# Altium project adapter.PrjPcb
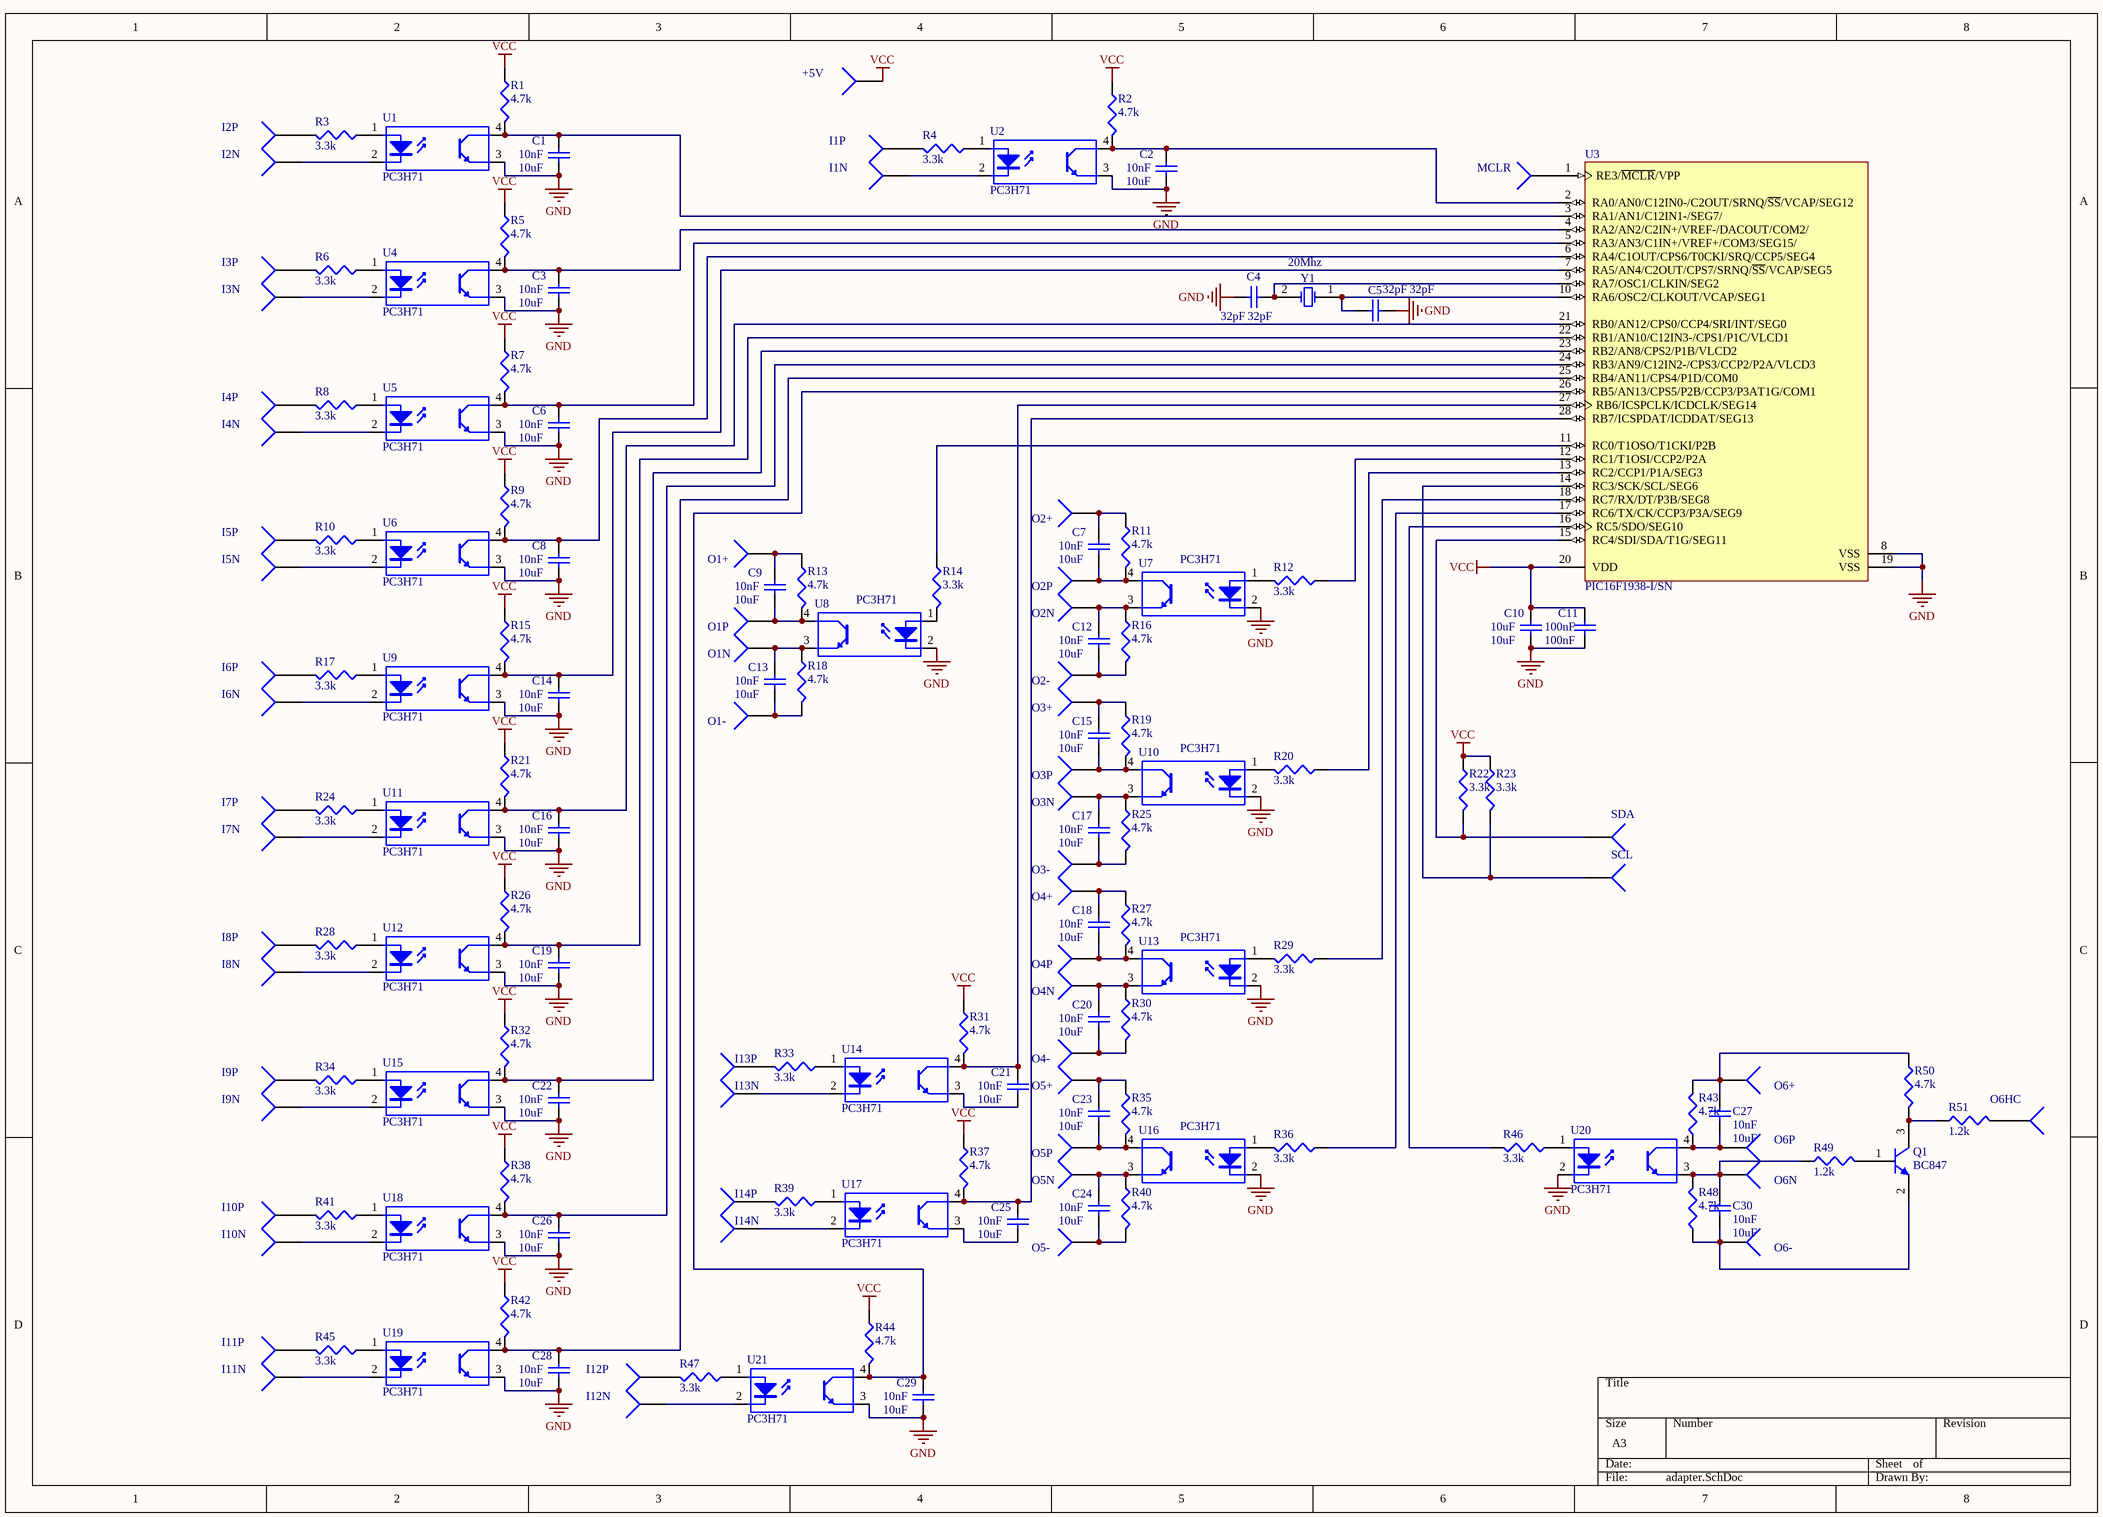
[diagram p0: adapter.SchDoc]
1 sheet, 161 parts. Net scope: global (net labels, ports and power ports of the same name join across sheets).
Board file: adapter.PcbDoc

## Sheet adapter.SchDoc
size A3

### Parts
+5V  IN  [PIN1L]  (value not drawn)
C1  10nF  value 10uF  [1608[0603]]
C2  10nF  value 10uF  [1608[0603]]
C3  10nF  value 10uF  [1608[0603]]
C4  32pF  [1608[0603]]
C5  32pF  [1608[0603]]
C6  10nF  value 10uF  [1608[0603]]
C7  10nF  value 10uF  [1608[0603]]
C8  10nF  value 10uF  [1608[0603]]
C9  10nF  value 10uF  [1608[0603]]
C10  10uF  [1608[0603]]
C11  100nF  [1608[0603]]
C12  10nF  value 10uF  [1608[0603]]
C13  10nF  value 10uF  [1608[0603]]
C14  10nF  value 10uF  [1608[0603]]
C15  10nF  value 10uF  [1608[0603]]
C16  10nF  value 10uF  [1608[0603]]
C17  10nF  value 10uF  [1608[0603]]
C18  10nF  value 10uF  [1608[0603]]
C19  10nF  value 10uF  [1608[0603]]
C20  10nF  value 10uF  [1608[0603]]
C21  10nF  value 10uF  [1608[0603]]
C22  10nF  value 10uF  [1608[0603]]
C23  10nF  value 10uF  [1608[0603]]
C24  10nF  value 10uF  [1608[0603]]
C25  10nF  value 10uF  [1608[0603]]
C26  10nF  value 10uF  [1608[0603]]
C27  10nF  value 10uF  [1608[0603]]
C28  10nF  value 10uF  [1608[0603]]
C29  10nF  value 10uF  [1608[0603]]
C30  10nF  value 10uF  [1608[0603]]
I1N  IN  [PIN1L]  (value not drawn)
I1P  IN  [PIN1L]  (value not drawn)
I2N  IN  [PIN1L]  (value not drawn)
I2P  IN  [PIN1L]  (value not drawn)
I3N  IN  [PIN1L]  (value not drawn)
I3P  IN  [PIN1L]  (value not drawn)
I4N  IN  [PIN1L]  (value not drawn)
I4P  IN  [PIN1L]  (value not drawn)
I5N  IN  [PIN1L]  (value not drawn)
I5P  IN  [PIN1L]  (value not drawn)
I6N  IN  [PIN1L]  (value not drawn)
I6P  IN  [PIN1L]  (value not drawn)
I7N  IN  [PIN1L]  (value not drawn)
I7P  IN  [PIN1L]  (value not drawn)
I8N  IN  [PIN1L]  (value not drawn)
I8P  IN  [PIN1L]  (value not drawn)
I9N  IN  [PIN1L]  (value not drawn)
I9P  IN  [PIN1L]  (value not drawn)
I10N  IN  [PIN1L]  (value not drawn)
I10P  IN  [PIN1L]  (value not drawn)
I11N  IN  [PIN1L]  (value not drawn)
I11P  IN  [PIN1L]  (value not drawn)
I12N  IN  [PIN1L]  (value not drawn)
I12P  IN  [PIN1L]  (value not drawn)
I13N  IN  [PIN1L]  (value not drawn)
I13P  IN  [PIN1L]  (value not drawn)
I14N  IN  [PIN1L]  (value not drawn)
I14P  IN  [PIN1L]  (value not drawn)
MCLR  IN  [PIN1L]  (value not drawn)
O1+  SDA  [PIN1L]  (value not drawn)
O1-  SDA  [PIN1L]  (value not drawn)
O1N  SDA  [PIN1L]  (value not drawn)
O1P  SDA  [PIN1L]  (value not drawn)
O2+  SDA  [PIN1L]  (value not drawn)
O2-  SDA  [PIN1L]  (value not drawn)
O2N  SDA  [PIN1L]  (value not drawn)
O2P  SDA  [PIN1L]  (value not drawn)
O3+  SDA  [PIN1L]  (value not drawn)
O3-  SDA  [PIN1L]  (value not drawn)
O3N  SDA  [PIN1L]  (value not drawn)
O3P  SDA  [PIN1L]  (value not drawn)
O4+  SDA  [PIN1L]  (value not drawn)
O4-  SDA  [PIN1L]  (value not drawn)
O4N  SDA  [PIN1L]  (value not drawn)
O4P  SDA  [PIN1L]  (value not drawn)
O5+  SDA  [PIN1L]  (value not drawn)
O5-  SDA  [PIN1L]  (value not drawn)
O5N  SDA  [PIN1L]  (value not drawn)
O5P  SDA  [PIN1L]  (value not drawn)
O6+  SDA  [PIN1L]  (value not drawn)
O6-  SDA  [PIN1L]  (value not drawn)
O6HC  SDA  [PIN1L]  (value not drawn)
O6N  SDA  [PIN1L]  (value not drawn)
O6P  SDA  [PIN1L]  (value not drawn)
Q1  BC847  [SOT-23_N]
R1  4.7k  [J1-0603]
R2  4.7k  [J1-0603]
R3  3.3k  [J1-0603]
R4  3.3k  [J1-0603]
R5  4.7k  [J1-0603]
R6  3.3k  [J1-0603]
R7  4.7k  [J1-0603]
R8  3.3k  [J1-0603]
R9  4.7k  [J1-0603]
R10  3.3k  [J1-0603]
R11  4.7k  [J1-0603]
R12  3.3k  [J1-0603]
R13  4.7k  [J1-0603]
R14  3.3k  [J1-0603]
R15  4.7k  [J1-0603]
R16  4.7k  [J1-0603]
R17  3.3k  [J1-0603]
R18  4.7k  [J1-0603]
R19  4.7k  [J1-0603]
R20  3.3k  [J1-0603]
R21  4.7k  [J1-0603]
R22  3.3k  [J1-0603]
R23  3.3k  [J1-0603]
R24  3.3k  [J1-0603]
R25  4.7k  [J1-0603]
R26  4.7k  [J1-0603]
R27  4.7k  [J1-0603]
R28  3.3k  [J1-0603]
R29  3.3k  [J1-0603]
R30  4.7k  [J1-0603]
R31  4.7k  [J1-0603]
R32  4.7k  [J1-0603]
R33  3.3k  [J1-0603]
R34  3.3k  [J1-0603]
R35  4.7k  [J1-0603]
R36  3.3k  [J1-0603]
R37  4.7k  [J1-0603]
R38  4.7k  [J1-0603]
R39  3.3k  [J1-0603]
R40  4.7k  [J1-0603]
R41  3.3k  [J1-0603]
R42  4.7k  [J1-0603]
R43  4.7k  [J1-0603]
R44  4.7k  [J1-0603]
R45  3.3k  [J1-0603]
R46  3.3k  [J1-0603]
R47  3.3k  [J1-0603]
R48  4.7k  [J1-0603]
R49  1.2k  [J1-0603]
R50  4.7k  [J1-0603]
R51  1.2k  [J1-0603]
SCL  SCL  [PIN1L]  (value not drawn)
SDA  SDA  [PIN1L]  (value not drawn)
U1  PC3H71  [PC3H71]
U2  PC3H71  [PC3H71]
U3  PIC16F1938-I/SN  [SOIC-SO28_N]
U4  PC3H71  [PC3H71]
U5  PC3H71  [PC3H71]
U6  PC3H71  [PC3H71]
U7  PC3H71  [PC3H71]
U8  PC3H71  [PC3H71]
U9  PC3H71  [PC3H71]
U10  PC3H71  [PC3H71]
U11  PC3H71  [PC3H71]
U12  PC3H71  [PC3H71]
U13  PC3H71  [PC3H71]
U14  PC3H71  [PC3H71]
U15  PC3H71  [PC3H71]
U16  PC3H71  [PC3H71]
U17  PC3H71  [PC3H71]
U18  PC3H71  [PC3H71]
U19  PC3H71  [PC3H71]
U20  PC3H71  [PC3H71]
U21  PC3H71  [PC3H71]
Y1  20Mhz  [XTAL]

### Nets
GND: C1.1 C2.1 C3.1 C4.1 C5.2 C6.1 C8.1 C10.1 C11.1 C14.1 C16.1 C19.1 C22.1 C26.1 C28.1 C29.1 U1.3(E) U2.3(E) U3.8(VSS) U3.19(VSS) U4.3(E) U5.3(E) U6.3(E) U7.2(K) U8.2(K) U9.3(E) U10.2(K) U11.3(E) U12.3(E) U13.2(K) U15.3(E) U16.2(K) U18.3(E) U19.3(E) U20.2(K) U21.3(E)
VCC: +5V.1 C10.2 C11.2 R1.1 R2.1 R5.1 R7.1 R9.1 R15.1 R21.1 R22.1 R23.1 R26.1 R31.1 R32.1 R37.1 R38.1 R42.1 R44.1 U3.20(VDD)
NetC1_2: C1.2 R1.2 U1.4(C) U3.3(RA1/AN1/C12IN1-/SEG7/)
NetC2_2: C2.2 R2.2 U2.4(C) U3.2(RA0/AN0/C12IN0-/C2OUT/SRNQ/~{SS}/VCAP/SEG12)
NetC3_2: C3.2 R5.2 U3.4(RA2/AN2/C2IN+/VREF-/DACOUT/COM2/) U4.4(C)
NetC4_2: C4.2 U3.9(RA7/OSC1/CLKIN/SEG2) Y1.2(OSC2)
NetC5_1: C5.1 U3.10(RA6/OSC2/CLKOUT/VCAP/SEG1) Y1.1(OSC1)
NetC6_2: C6.2 R7.2 U3.5(RA3/AN3/C1IN+/VREF+/COM3/SEG15/) U5.4(C)
NetC7_1: C7.1 O2P.1 R11.2 U7.4(C)
NetC7_2: C7.2 O2+.1 R11.1
NetC8_2: C8.2 R9.2 U3.6(RA4/C1OUT/CPS6/T0CKI/SRQ/CCP5/SEG4) U6.4(C)
NetC9_1: C9.1 O1P.1 R13.2 U8.4(C)
NetC9_2: C9.2 O1+.1 R13.1
NetC12_1: C12.1 O2-.1 R16.2
NetC12_2: C12.2 O2N.1 R16.1 U7.3(E)
NetC13_1: C13.1 O1-.1 R18.2
NetC13_2: C13.2 O1N.1 R18.1 U8.3(E)
NetC14_2: C14.2 R15.2 U3.7(RA5/AN4/C2OUT/CPS7/SRNQ/~{SS}/VCAP/SEG5) U9.4(C)
NetC15_1: C15.1 O3P.1 R19.2 U10.4(C)
NetC15_2: C15.2 O3+.1 R19.1
NetC16_2: C16.2 R21.2 U3.21(RB0/AN12/CPS0/CCP4/SRI/INT/SEG0) U11.4(C)
NetC17_1: C17.1 O3-.1 R25.2
NetC17_2: C17.2 O3N.1 R25.1 U10.3(E)
NetC18_1: C18.1 O4P.1 R27.2 U13.4(C)
NetC18_2: C18.2 O4+.1 R27.1
NetC19_2: C19.2 R26.2 U3.22(RB1/AN10/C12IN3-/CPS1/P1C/VLCD1) U12.4(C)
NetC20_1: C20.1 O4-.1 R30.2
NetC20_2: C20.2 O4N.1 R30.1 U13.3(E)
NetC21_1: C21.1 U14.3(E)
NetC21_2: C21.2 R31.2 U3.27(RB6/ICSPCLK/ICDCLK/SEG14) U14.4(C)
NetC22_2: C22.2 R32.2 U3.23(RB2/AN8/CPS2/P1B/VLCD2) U15.4(C)
NetC23_1: C23.1 O5P.1 R35.2 U16.4(C)
NetC23_2: C23.2 O5+.1 R35.1
NetC24_1: C24.1 O5-.1 R40.2
NetC24_2: C24.2 O5N.1 R40.1 U16.3(E)
NetC25_1: C25.1 U17.3(E)
NetC25_2: C25.2 R37.2 U3.28(RB7/ICSPDAT/ICDDAT/SEG13) U17.4(C)
NetC26_2: C26.2 R38.2 U3.24(RB3/AN9/C12IN2-/CPS3/CCP2/P2A/VLCD3) U18.4(C)
NetC27_1: C27.1 O6P.1 R43.2 U20.4(C)
NetC27_2: C27.2 O6+.1 R43.1 R50.1
NetC28_2: C28.2 R42.2 U3.25(RB4/AN11/CPS4/P1D/COM0) U19.4(C)
NetC29_2: C29.2 R44.2 U3.26(RB5/AN13/CPS5/P2B/CCP3/P3AT1G/COM1) U21.4(C)
NetC30_1: C30.1 O6-.1 Q1.2(E) R48.2
NetC30_2: C30.2 O6N.1 R48.1 R49.1 U20.3(E)
NetI1N_1: I1N.1 U2.2(K)
NetI1P_1: I1P.1 R4.2
NetI2N_1: I2N.1 U1.2(K)
NetI2P_1: I2P.1 R3.2
NetI3N_1: I3N.1 U4.2(K)
NetI3P_1: I3P.1 R6.2
NetI4N_1: I4N.1 U5.2(K)
NetI4P_1: I4P.1 R8.2
NetI5N_1: I5N.1 U6.2(K)
NetI5P_1: I5P.1 R10.2
NetI6N_1: I6N.1 U9.2(K)
NetI6P_1: I6P.1 R17.2
NetI7N_1: I7N.1 U11.2(K)
NetI7P_1: I7P.1 R24.2
NetI8N_1: I8N.1 U12.2(K)
NetI8P_1: I8P.1 R28.2
NetI9N_1: I9N.1 U15.2(K)
NetI9P_1: I9P.1 R34.2
NetI10N_1: I10N.1 U18.2(K)
NetI10P_1: I10P.1 R41.2
NetI11N_1: I11N.1 U19.2(K)
NetI11P_1: I11P.1 R45.2
NetI12N_1: I12N.1 U21.2(K)
NetI12P_1: I12P.1 R47.2
NetI13N_1: I13N.1 U14.2(K)
NetI13P_1: I13P.1 R33.2
NetI14N_1: I14N.1 U17.2(K)
NetI14P_1: I14P.1 R39.2
NetMCLR_1: MCLR.1 U3.1(RE3/~{MCLR}/VPP)
NetO6HC_1: O6HC.1 R51.2
NetQ1_1: Q1.1(B) R49.2
NetQ1_3: Q1.3(C) R50.2 R51.1
NetR3_1: R3.1 U1.1(A)
NetR4_1: R4.1 U2.1(A)
NetR6_1: R6.1 U4.1(A)
NetR8_1: R8.1 U5.1(A)
NetR10_1: R10.1 U6.1(A)
NetR12_1: R12.1 U3.12(RC1/T1OSI/CCP2/P2A)
NetR12_2: R12.2 U7.1(A)
NetR14_1: R14.1 U3.11(RC0/T1OSO/T1CKI/P2B)
NetR14_2: R14.2 U8.1(A)
NetR17_1: R17.1 U9.1(A)
NetR20_1: R20.1 U3.13(RC2/CCP1/P1A/SEG3)
NetR20_2: R20.2 U10.1(A)
NetR22_2: R22.2 SDA.1 U3.15(RC4/SDI/SDA/T1G/SEG11)
NetR23_2: R23.2 SCL.1 U3.14(RC3/SCK/SCL/SEG6)
NetR24_1: R24.1 U11.1(A)
NetR28_1: R28.1 U12.1(A)
NetR29_1: R29.1 U3.18(RC7/RX/DT/P3B/SEG8)
NetR29_2: R29.2 U13.1(A)
NetR33_1: R33.1 U14.1(A)
NetR34_1: R34.1 U15.1(A)
NetR36_1: R36.1 U3.17(RC6/TX/CK/CCP3/P3A/SEG9)
NetR36_2: R36.2 U16.1(A)
NetR39_1: R39.1 U17.1(A)
NetR41_1: R41.1 U18.1(A)
NetR45_1: R45.1 U19.1(A)
NetR46_1: R46.1 U3.16(RC5/SDO/SEG10)
NetR46_2: R46.2 U20.1(A)
NetR47_1: R47.1 U21.1(A)

### Library data of the parts
+5V I1N I1P I2N I2P I3N I3P I4N I4P I5N I5P I6N I6P I7N I7P I8N I8P I9N I9P I10N I10P I11N I11P I12N I12P I13N I13P I14N I14P MCLR O1+ O1- O1N O1P O2+ O2- O2N O2P O3+ O3- O3N O3P O4+ O4- O4N O4P O5+ O5- O5N O5P O6+ O6- O6HC O6N O6P SCL SDA = Socket: LatestRevisionDate: 17-Jul-2002; LatestRevisionNote: Re-released for DXP Platform.; Publisher: Altium Limited
C1-C30 = Cap: Capacitor; Published: 8-Jun-2000; LatestRevisionDate: 17-Jul-2002; LatestRevisionNote: Re-released for DXP Platform.; PackageReference: RAD-0.3; Publisher: Altium Limited; PackageDescription: Radial Cap, Thru-Hole; 2 Leads; 0.3 in Pin Spacing
  C4 C5: Value: 32pF
  C10: Value: 10uF
  C11: Value: 100nF
Q1 = NPN: NPN Bipolar Transistor; Published: 8-Jun-2000; LatestRevisionDate: 17-Jul-2002; LatestRevisionNote: Re-released for DXP Platform.; PackageReference: TO-226-AA; Publisher: Altium Limited; PackageDescription: TO, Flat Index; 3 In-Line, Axial Leads; Body Dia. 4.8mm; Leads 0.55 x 0.51 mm (max); Code_JEDEC: TO-226-AA
R1 R2 R5 R7 R9 R11 R13 R15 R16 R18 R19 R21-R23 R25-R27 R30-R32 R35 R37 R38 R40 R42-R44 R48-R51 = Res3: Resistor; Value: 22K; Published: 8-Jun-2000; LatestRevisionDate: 29-May-2009; LatestRevisionNote: IPC-7351 Footprint Added.; PackageReference: J1-0603; Publisher: Altium Limited; PackageDescription: Chip Resistor
R3 R4 R6 R8 R10 R12 R14 R17 R20 R24 R28 R29 R33 R34 R36 R39 R41 R45-R47 = Res3: Resistor; Published: 8-Jun-2000; LatestRevisionDate: 29-May-2009; LatestRevisionNote: IPC-7351 Footprint Added.; PackageReference: J1-0603; Publisher: Altium Limited; PackageDescription: Chip Resistor; Value: 3.3K
U1 U2 U4-U21 = Optoisolator1: 4-Pin Phototransistor Optocoupler; Published: 24-Mar-1999; LatestRevisionDate: 04-Mar-2005; LatestRevisionNote: Sch pins 3 & 4 Swapped.; DatasheetVersion: Nov-2003; PackageReference: DIP-4; Publisher: Altium Limited
U3 = PIC16F1936-I/SO: CMOS Microcontroller with LCD Driver, 8K (words) Program Memory, 256 Bytes Data Memory, 512 Bytes SRAM, 25 I/O's, 28-Pin SOIC, Industrial Temperature; Published: 40149; LatestRevisionDate: 11-Aug-2010; LatestRevisionNote: Sch. layout revised.; DatasheetVersion: revC, Sep-2009; PackageVersion: revBB, Aug-2009; PackageReference: SOIC-SO28; Publisher: Altium Limited; PackageDescription: 28-Lead Plastic Small Outline (SO) - Wide 7.50mm Body [SOIC]; Supplier 1: Digi-Key; Supplier Part Number 1: PIC16F1936-I/SO-ND; Supplier 2: Farnell; Supplier Part Number 2: 1755820; Code_JEDEC: MS-013; ComponentLink1Description: Datasheet; ComponentLink1URL: http://ww1.microchip.com/downloads/en/DeviceDoc/41364C.pdf; ComponentLink2Description: Packaging Specification; ComponentLink2URL: http://www.microchip.com/stellent/groups/techpub_sg/documents/packagingspec/en012702.pdf; ComponentLink3Description: Microchip.com Home; ComponentLink3URL: http://www.microchip.com/
Y1 = XTAL: Crystal Oscillator; Published: 8-Jun-2000; LatestRevisionDate: 17-Jul-2002; LatestRevisionNote: Re-released for DXP Platform.; PackageReference: R38; Publisher: Altium Limited; PackageDescription: Crystal, Thru-Hole; 2 Leads; Body 3.1 x 8.2 mm (Dia.xH)